# Altium schematic sheet vme_can_vme_1.SchDoc: =GlobalProjectName
size 410 x 297 mm; SheetNumber: 8; SheetTotal: 8; PageSetup: Record=PageOptions|CenterHorizontal=True|CenterVertical=True|PrintScale=1.00|XCorrection=1.00|YCorrection=1.00|PrintKind=1|BorderSize=5000000|LeftOffset=0|BottomOffset=0|Orientation=2|PaperLength=1000|PaperWidth=1000|Scale=100|PaperSource=15|PrintQuality=1200|MediaType=1|DitherType=10|PaperKind=A3|PrintScaleMode=1; Weight: -; ScaleFactor: -
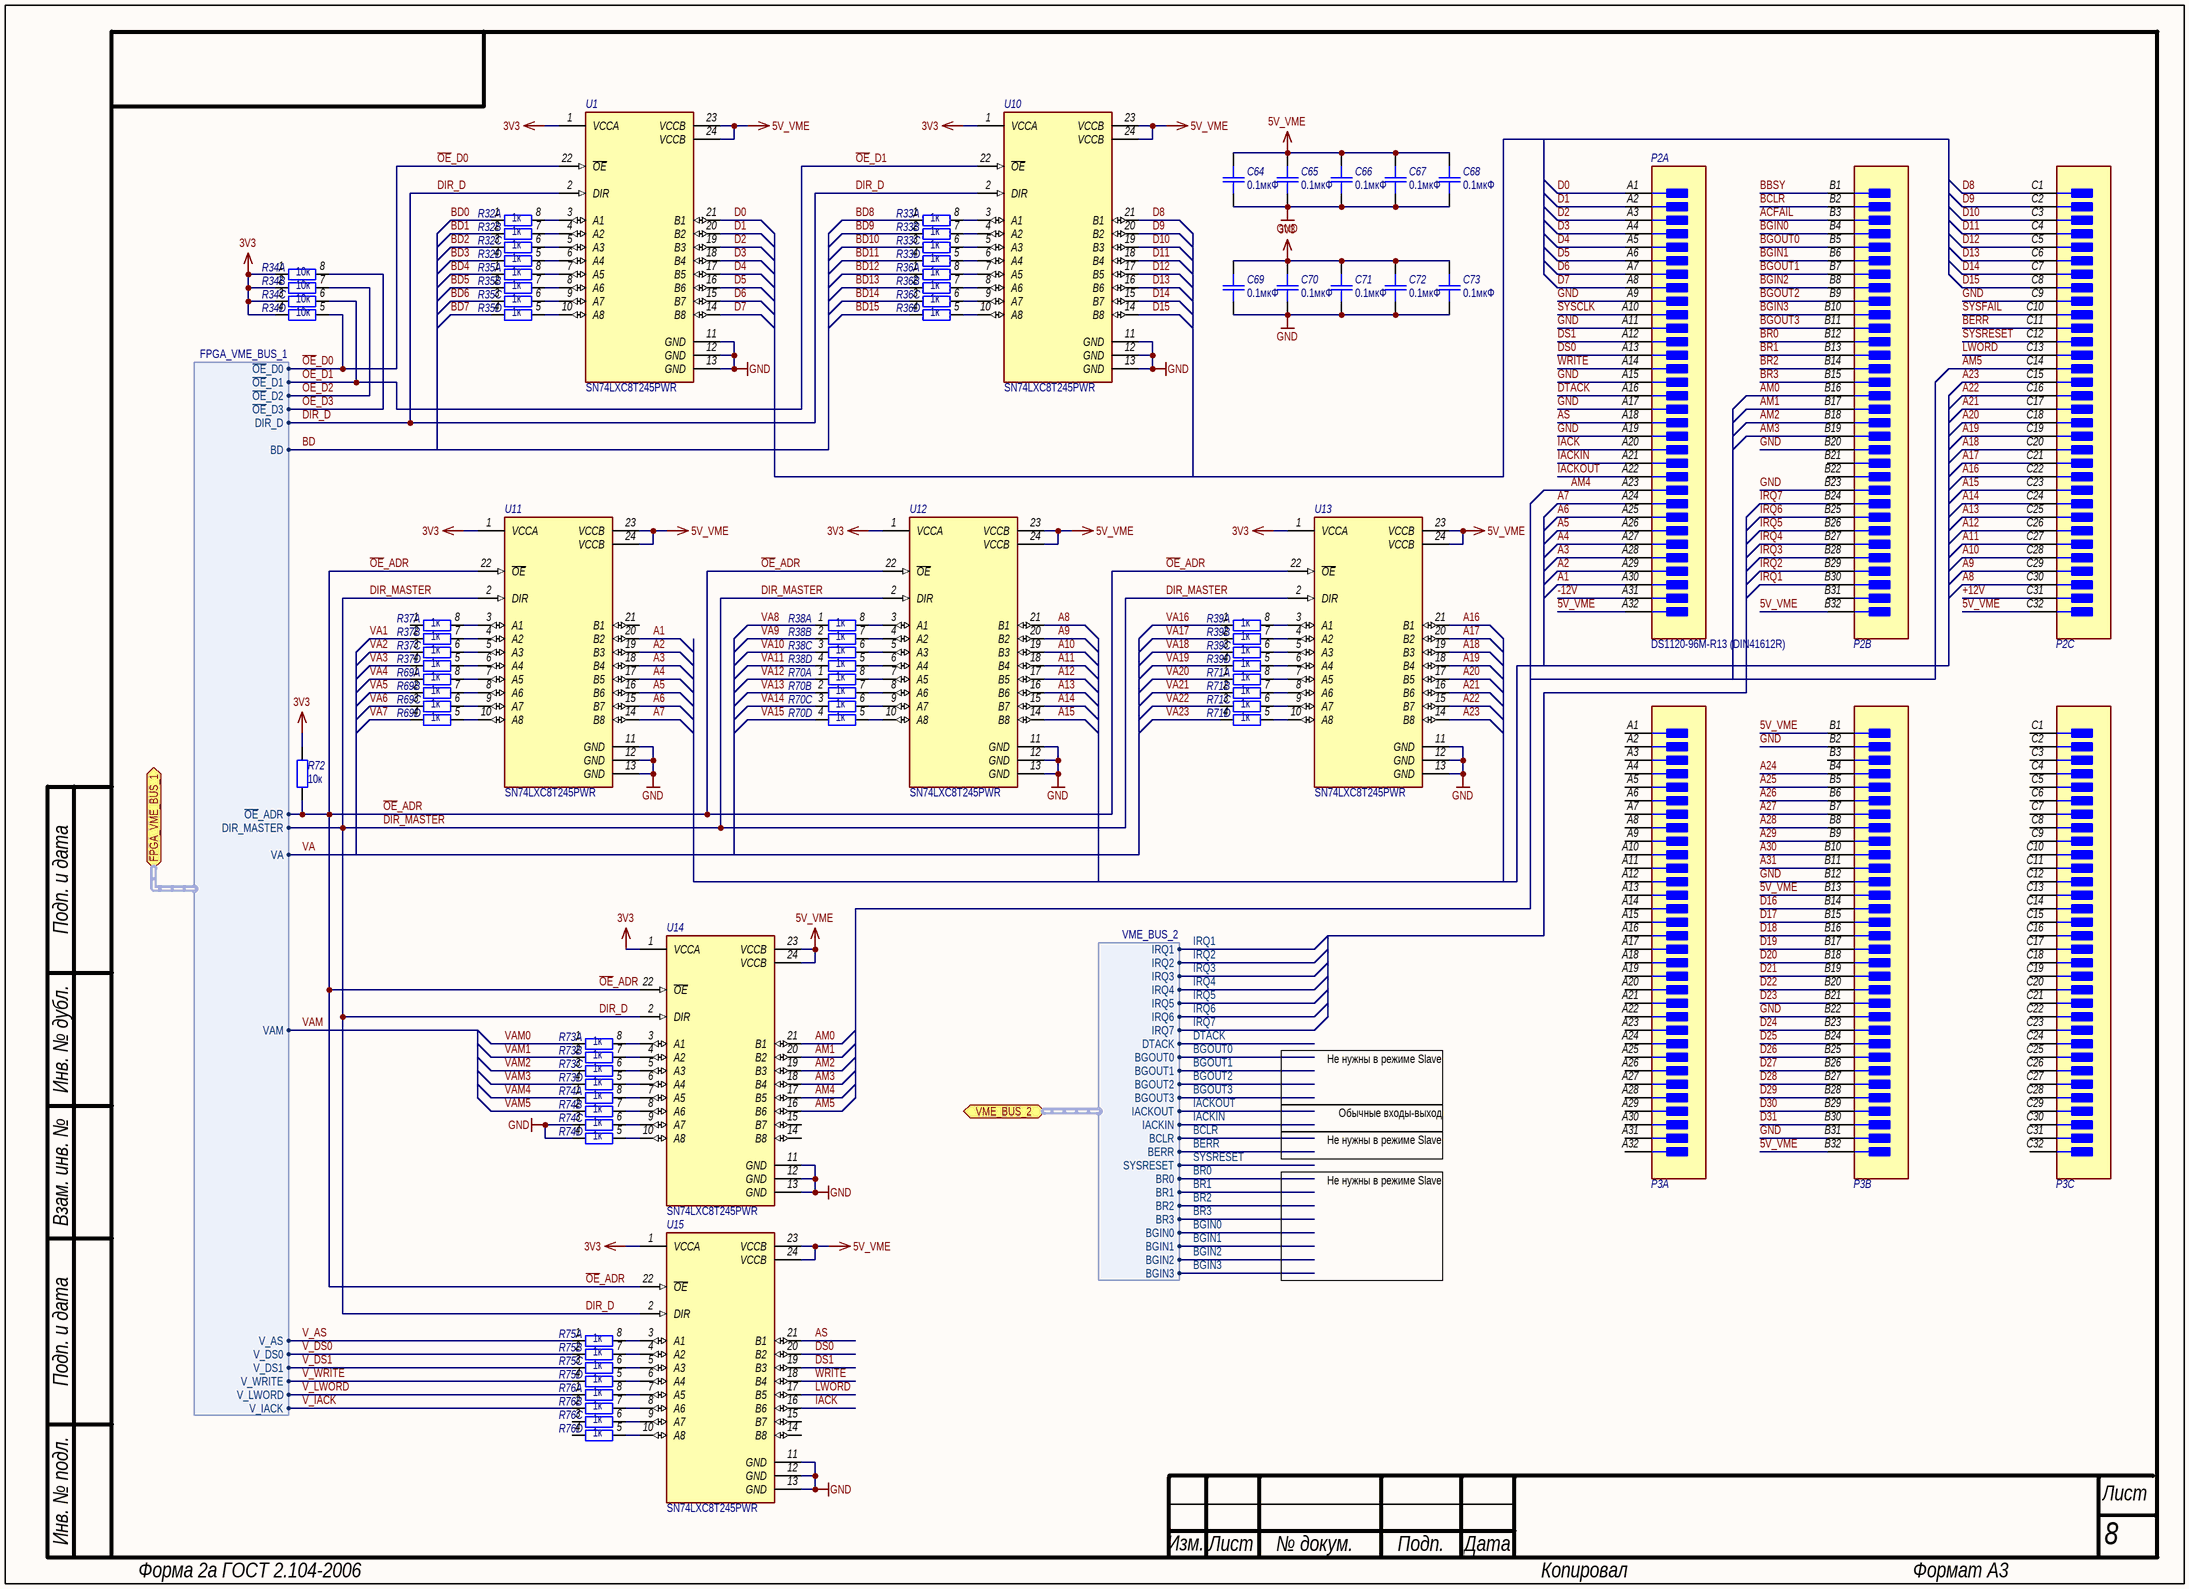
[diagram p0: vme_can_vme_1.SchDoc]

## Parts
C64  0.1мкФ  [SMD_C0805]
C65  0.1мкФ  [SMD_C0805]
C66  0.1мкФ  [SMD_C0805]
C67  0.1мкФ  [SMD_C0805]
C68  0.1мкФ  [SMD_C0805]
C69  0.1мкФ  [SMD_C0805]
C70  0.1мкФ  [SMD_C0805]
C71  0.1мкФ  [SMD_C0805]
C72  0.1мкФ  [SMD_C0805]
C73  0.1мкФ  [SMD_C0805]
P2  DS1120-96M-R13 (DIN41612R)  [DS1120-96M-R13]  (parts A,B,C of 3)
P3  DS1120-96M-R13 (DIN41612R)  [DS1120-96M-R13]  (value not drawn)  (parts A,B,C of 3)
R32  value 1к  [TC124]  (hidden comment: 4 Chip Resistor Array)  (parts A,B,C,D of 4)
R33  value 1к  [TC124]  (hidden comment: 4 Chip Resistor Array)  (parts A,B,C,D of 4)
R34  value 10к  [TC124]  (hidden comment: 4 Chip Resistor Array)  (parts A,B,C,D of 4)
R35  value 1к  [TC124]  (hidden comment: 4 Chip Resistor Array)  (parts A,B,C,D of 4)
R36  value 1к  [TC124]  (hidden comment: 4 Chip Resistor Array)  (parts A,B,C,D of 4)
R37  value 1к  [TC124]  (hidden comment: 4 Chip Resistor Array)  (parts A,B,C,D of 4)
R38  value 1к  [TC124]  (hidden comment: 4 Chip Resistor Array)  (parts A,B,C,D of 4)
R39  value 1к  [TC124]  (hidden comment: 4 Chip Resistor Array)  (parts A,B,C,D of 4)
R69  value 1к  [TC124]  (hidden comment: 4 Chip Resistor Array)  (parts A,B,C,D of 4)
R70  value 1к  [TC124]  (hidden comment: 4 Chip Resistor Array)  (parts A,B,C,D of 4)
R71  value 1к  [TC124]  (hidden comment: 4 Chip Resistor Array)  (parts A,B,C,D of 4)
R72  10к  [SMD_0805]
R73  value 1к  [TC124]  (hidden comment: 4 Chip Resistor Array)  (parts A,B,C,D of 4)
R74  value 1к  [TC124]  (hidden comment: 4 Chip Resistor Array)  (parts A,B,C,D of 4)
R75  value 1к  [TC124]  (hidden comment: 4 Chip Resistor Array)  (parts A,B,C,D of 4)
R76  value 1к  [TC124]  (hidden comment: 4 Chip Resistor Array)  (parts A,B,C,D of 4)
U1  SN74LXC8T245PWR  [TSSOP-24]
U10  SN74LXC8T245PWR  [TSSOP-24]
U11  SN74LXC8T245PWR  [TSSOP-24]
U12  SN74LXC8T245PWR  [TSSOP-24]
U13  SN74LXC8T245PWR  [TSSOP-24]
U14  SN74LXC8T245PWR  [TSSOP-24]
U15  SN74LXC8T245PWR  [TSSOP-24]

## Ports
FPGA_VME_BUS_1 (bidir, harness FPGA_VME_BUS_1), VME_BUS_2 (bidir, harness VME_BUS_2)

## Harnesses
VME_BUS_2: IRQ1, IRQ2, IRQ3, IRQ4, IRQ5, IRQ6, IRQ7, DTACK, BGOUT0, BGOUT1, BGOUT2, BGOUT3, IACKOUT, IACKIN, BCLR, BERR, SYSRESET, BR0, BR1, BR2, BR3, BGIN0, BGIN1, BGIN2, BGIN3
FPGA_VME_BUS_1: ~{OE}_D0, ~{OE}_D1, ~{OE}_D2, ~{OE}_D3, DIR_D, BD, ~{OE}_ADR, DIR_MASTER, VA, VAM, V_AS, V_DS0, V_DS1, V_WRITE, V_LWORD, V_IACK

## Nets
3V3: C69.2 C70.2 C71.2 C72.2 C73.2 R34.1 R34.2 R34.3 R34.4 R72.2 U1.1(VCCA) U10.1(VCCA) U11.1(VCCA) U12.1(VCCA) U13.1(VCCA) U14.1(VCCA) U15.1(VCCA)
5V_VME: C64.2 C65.2 C66.2 C67.2 C68.2 P2.A32 P2.B32 P2.C32 P3.B1 P3.B13 P3.B32 U1.23(VCCB) U1.24(VCCB) U10.23(VCCB) U10.24(VCCB) U11.23(VCCB) U11.24(VCCB) U12.23(VCCB) U12.24(VCCB) U13.23(VCCB) U13.24(VCCB) U14.23(VCCB) U14.24(VCCB) U15.23(VCCB) U15.24(VCCB)
GND: C64.1 C65.1 C66.1 C67.1 C68.1 C69.1 C70.1 C71.1 C72.1 C73.1 P2.A9 P2.A11 P2.A15 P2.A17 P2.A19 P2.B20 P2.B23 P2.C9 P3.B2 P3.B12 P3.B22 P3.B31 R74.3 R74.4 U1.11(GND) U1.12(GND) U1.13(GND) U10.11(GND) U10.12(GND) U10.13(GND) U11.11(GND) U11.12(GND) U11.13(GND) U12.11(GND) U12.12(GND) U12.13(GND) U13.11(GND) U13.12(GND) U13.13(GND) U14.11(GND) U14.12(GND) U14.13(GND) U15.11(GND) U15.12(GND) U15.13(GND)
+12V: P2.C31
-12V: P2.A31
A1: P2.A30 U11.20(B2)
A2: P2.A29 U11.19(B3)
A3: P2.A28 U11.18(B4)
A4: P2.A27 U11.17(B5)
A5: P2.A26 U11.16(B6)
A6: P2.A25 U11.15(B7)
A7: P2.A24 U11.14(B8)
A8: P2.C30 U12.21(B1)
A9: P2.C29 U12.20(B2)
A10: P2.C28 U12.19(B3)
A11: P2.C27 U12.18(B4)
A12: P2.C26 U12.17(B5)
A13: P2.C25 U12.16(B6)
A14: P2.C24 U12.15(B7)
A15: P2.C23 U12.14(B8)
A16: P2.C22 U13.21(B1)
A17: P2.C21 U13.20(B2)
A18: P2.C20 U13.19(B3)
A19: P2.C19 U13.18(B4)
A20: P2.C18 U13.17(B5)
A21: P2.C17 U13.16(B6)
A22: P2.C16 U13.15(B7)
A23: P2.C15 U13.14(B8)
A24: P3.B4
A25: P3.B5
A26: P3.B6
A27: P3.B7
A28: P3.B8
A29: P3.B9
A30: P3.B10
A31: P3.B11
ACFAIL: P2.B3
AM0: P2.B16 U14.21(B1)
AM1: P2.B17 U14.20(B2)
AM2: P2.B18 U14.19(B3)
AM3: P2.B19 U14.18(B4)
AM4: P2.A23 U14.17(B5)
AM5: P2.C14 U14.16(B6)
AS: P2.A18 U15.21(B1)
BBSY: P2.B1
BCLR: P2.B2 ; port VME_BUS_2.BCLR
BD0: R32.1
BD1: R32.2
BD2: R32.3
BD3: R32.4
BD4: R35.1
BD5: R35.2
BD6: R35.3
BD7: R35.4
BD8: R33.1
BD9: R33.2
BD10: R33.3
BD11: R33.4
BD12: R36.1
BD13: R36.2
BD14: R36.3
BD15: R36.4
BERR: P2.C11 ; port VME_BUS_2.BERR
BGIN0: P2.B4 ; port VME_BUS_2.BGIN0
BGIN1: P2.B6 ; port VME_BUS_2.BGIN1
BGIN2: P2.B8 ; port VME_BUS_2.BGIN2
BGIN3: P2.B10 ; port VME_BUS_2.BGIN3
BGOUT0: P2.B5 ; port VME_BUS_2.BGOUT0
BGOUT1: P2.B7 ; port VME_BUS_2.BGOUT1
BGOUT2: P2.B9 ; port VME_BUS_2.BGOUT2
BGOUT3: P2.B11 ; port VME_BUS_2.BGOUT3
BR0: P2.B12 ; port VME_BUS_2.BR0
BR1: P2.B13 ; port VME_BUS_2.BR1
BR2: P2.B14 ; port VME_BUS_2.BR2
BR3: P2.B15 ; port VME_BUS_2.BR3
D0: P2.A1 U1.21(B1)
D1: P2.A2 U1.20(B2)
D2: P2.A3 U1.19(B3)
D3: P2.A4 U1.18(B4)
D4: P2.A5 U1.17(B5)
D5: P2.A6 U1.16(B6)
D6: P2.A7 U1.15(B7)
D7: P2.A8 U1.14(B8)
D8: P2.C1 U10.21(B1)
D9: P2.C2 U10.20(B2)
D10: P2.C3 U10.19(B3)
D11: P2.C4 U10.18(B4)
D12: P2.C5 U10.17(B5)
D13: P2.C6 U10.16(B6)
D14: P2.C7 U10.15(B7)
D15: P2.C8 U10.14(B8)
D16: P3.B14
D17: P3.B15
D18: P3.B16
D19: P3.B17
D20: P3.B18
D21: P3.B19
D22: P3.B20
D23: P3.B21
D24: P3.B23
D25: P3.B24
D26: P3.B25
D27: P3.B26
D28: P3.B27
D29: P3.B28
D30: P3.B29
D31: P3.B30
DIR_D: U1.2(DIR) U10.2(DIR) U11.2(DIR) U12.2(DIR) U13.2(DIR) U14.2(DIR) U15.2(DIR) ; port FPGA_VME_BUS_1.DIR_D, port FPGA_VME_BUS_1.DIR_MASTER  [also labelled DIR_MASTER]
DS0: P2.A13 U15.20(B2)
DS1: P2.A12 U15.19(B3)
DTACK: P2.A16 ; port VME_BUS_2.DTACK
IACK: P2.A20 U15.16(B6)
IACKIN: P2.A21 ; port VME_BUS_2.IACKIN
IACKOUT: P2.A22 ; port VME_BUS_2.IACKOUT
IRQ1: P2.B30 ; port VME_BUS_2.IRQ1
IRQ2: P2.B29 ; port VME_BUS_2.IRQ2
IRQ3: P2.B28 ; port VME_BUS_2.IRQ3
IRQ4: P2.B27 ; port VME_BUS_2.IRQ4
IRQ5: P2.B26 ; port VME_BUS_2.IRQ5
IRQ6: P2.B25 ; port VME_BUS_2.IRQ6
IRQ7: P2.B24 ; port VME_BUS_2.IRQ7
LWORD: P2.C13 U15.17(B5)
~{OE}_ADR: R72.1 U11.22(~{OE}) U12.22(~{OE}) U13.22(~{OE}) U14.22(~{OE}) U15.22(~{OE}) ; port FPGA_VME_BUS_1.~{OE}_ADR
~{OE}_D0: R34.5 U1.22(~{OE}) ; port FPGA_VME_BUS_1.~{OE}_D0
~{OE}_D1: R34.6 U10.22(~{OE}) ; port FPGA_VME_BUS_1.~{OE}_D1
~{OE}_D2: R34.7 ; port FPGA_VME_BUS_1.~{OE}_D2
~{OE}_D3: R34.8 ; port FPGA_VME_BUS_1.~{OE}_D3
SYSCLK: P2.A10
SYSFAIL: P2.C10
SYSRESET: P2.C12 ; port VME_BUS_2.SYSRESET
V_AS: R75.1 ; port FPGA_VME_BUS_1.V_AS
V_DS0: R75.2 ; port FPGA_VME_BUS_1.V_DS0
V_DS1: R75.3 ; port FPGA_VME_BUS_1.V_DS1
V_IACK: R76.2 ; port FPGA_VME_BUS_1.V_IACK
V_LWORD: R76.1 ; port FPGA_VME_BUS_1.V_LWORD
V_WRITE: R75.4 ; port FPGA_VME_BUS_1.V_WRITE
VA1: R37.2
VA2: R37.3
VA3: R37.4
VA4: R69.1
VA5: R69.2
VA6: R69.3
VA7: R69.4
VA8: R38.1
VA9: R38.2
VA10: R38.3
VA11: R38.4
VA12: R70.1
VA13: R70.2
VA14: R70.3
VA15: R70.4
VA16: R39.1
VA17: R39.2
VA18: R39.3
VA19: R39.4
VA20: R71.1
VA21: R71.2
VA22: R71.3
VA23: R71.4
VAM0: R73.1
VAM1: R73.2
VAM2: R73.3
VAM3: R73.4
VAM4: R74.1
VAM5: R74.2
WRITE: P2.A14 U15.18(B4)
NetR32_5: R32.5 U1.6(A4)
NetR32_6: R32.6 U1.5(A3)
NetR32_7: R32.7 U1.4(A2)
NetR32_8: R32.8 U1.3(A1)
NetR33_5: R33.5 U10.6(A4)
NetR33_6: R33.6 U10.5(A3)
NetR33_7: R33.7 U10.4(A2)
NetR33_8: R33.8 U10.3(A1)
NetR35_5: R35.5 U1.10(A8)
NetR35_6: R35.6 U1.9(A7)
NetR35_7: R35.7 U1.8(A6)
NetR35_8: R35.8 U1.7(A5)
NetR36_5: R36.5 U10.10(A8)
NetR36_6: R36.6 U10.9(A7)
NetR36_7: R36.7 U10.8(A6)
NetR36_8: R36.8 U10.7(A5)
NetR37_5: R37.5 U11.6(A4)
NetR37_6: R37.6 U11.5(A3)
NetR37_7: R37.7 U11.4(A2)
NetR37_8: R37.8 U11.3(A1)
NetR38_5: R38.5 U12.6(A4)
NetR38_6: R38.6 U12.5(A3)
NetR38_7: R38.7 U12.4(A2)
NetR38_8: R38.8 U12.3(A1)
NetR39_5: R39.5 U13.6(A4)
NetR39_6: R39.6 U13.5(A3)
NetR39_7: R39.7 U13.4(A2)
NetR39_8: R39.8 U13.3(A1)
NetR69_5: R69.5 U11.10(A8)
NetR69_6: R69.6 U11.9(A7)
NetR69_7: R69.7 U11.8(A6)
NetR69_8: R69.8 U11.7(A5)
NetR70_5: R70.5 U12.10(A8)
NetR70_6: R70.6 U12.9(A7)
NetR70_7: R70.7 U12.8(A6)
NetR70_8: R70.8 U12.7(A5)
NetR71_5: R71.5 U13.10(A8)
NetR71_6: R71.6 U13.9(A7)
NetR71_7: R71.7 U13.8(A6)
NetR71_8: R71.8 U13.7(A5)
NetR73_5: R73.5 U14.6(A4)
NetR73_6: R73.6 U14.5(A3)
NetR73_7: R73.7 U14.4(A2)
NetR73_8: R73.8 U14.3(A1)
NetR74_5: R74.5 U14.10(A8)
NetR74_6: R74.6 U14.9(A7)
NetR74_7: R74.7 U14.8(A6)
NetR74_8: R74.8 U14.7(A5)
NetR75_5: R75.5 U15.6(A4)
NetR75_6: R75.6 U15.5(A3)
NetR75_7: R75.7 U15.4(A2)
NetR75_8: R75.8 U15.3(A1)
NetR76_5: R76.5 U15.10(A8)
NetR76_6: R76.6 U15.9(A7)
NetR76_7: R76.7 U15.8(A6)
NetR76_8: R76.8 U15.7(A5)

Not connected (* = marked no-connect by the designer): P2 B21 B22 B31; P3 A1 A2 A3 A4 A5 A6 A7 A8 A9 A10 A11 A12 A13 A14 A15 A16 A17 A18 A19 A20 A21 A22 A23 A24 A25 A26 A27 A28 A29 A30 A31 A32 B3 C1 C2 C3 C4 C5 C6 C7 C8 C9 C10 C11 C12 C13 C14 C15 C16 C17 C18 C19 C20 C21 C22 C23 C24 C25 C26 C27 C28 C29 C30 C31 C32; R37 1; R76 3 4; U11 21(B1); U14 14(B8) 15(B7); U15 14(B8) 15(B7)

## Buses and harness runs
bus BD
bus VA
bus VAM

## Notes on the sheet
- Не нужны в режиме Slave
- Обычные входы-выход
- Подп. и дата
- Инв. № дубл.
- Взам. инв. №
- Инв. № подл.
- Изм.
- Лист
- № докум.
- Подп.
- Дата
- Форма 2а ГОСТ 2.104-2006
- Копировал
- Формат А3

## Library data of the parts
C64-C73 = Capacitor: Назначение: SMD-конденсатор; Наименование: Конденсатор; Потребление, Вт: 0; Value: 0.1мкФ
P2 P3 = DS1120-96M-R13: Conn Backplane PL 96 POS 2.54mm Solder RA Thru-Hole Box; Manufacturer: TE; Manufacturer Part Number: 5650473-5; Conn Gender: Male; Number Of Contacts: 96; Current Rating: 1.5A; Conn Orientation: Right Angle; Voltage Rating: 250V; Потребление, Вт: 0.0; ComponentLink2URL: http://outer.connfly.group/static/upload/file/pdf/DS1119.pdf; RoHS: TRUE; Lead Free: Yes; Package: 5650473-5; Number Of Rows: 3; Device Class L3: unset; Contact Material: Gold,Nickel; Device Class L1: Connectors; Footprint Url: https://www.te.com/commerce/DocumentDelivery/DDEController?Action=showdoc&DocId=Customer+Drawing%7F5650473%7FC%7Fpdf%7FEnglish%7FENG_CD_5650473_C.pdf%7F5650473-5; Temperature: -55°C to +105°C; ComponentLink2Description: Datasheet; Device Class L2: Backplane Connectors; Category: Conn; Height: 11.1mm; Octopart: https://octopart.com/5650473-5-te+connectivity-39687507; Pitch: 2.54mm; Digikey Description: CONN DIN PLUG 96POS PCB RA GOLD; Mouser Description: Conn DIN 41612 PIN 96 POS 2.54mm Solder RA Thru-Hole Box; Temperature Range Low: -55°C; Automotive: No; Temperature Range High: +105°C; Назначение: Conn Backplane PL 96 POS 2.54mm Solder RA Thru-Hole Box; Наименование: DS1120-96M-R13 (DIN41612R)
R32-R39 R69-R71 R73-R76 = Resistor-4: Потребление, Вт: 0.0; Назначение: 4 Chip Resistor Array; Наименование: 4 Chip Resistor Array
R72 = Resistor: Наименование: Резистор; Назначение: SMD-резистор; Потребление, Вт: 0,001; Value: 10к
U1 U10-U15 = SN74LXC8T245PWR: Dual-Supply Bus Transceiver with Configurable Level Shifting / and 3-State Outputs; Потрбление, Вт: 0.01; ComponentLink2Description: Datasheet; ComponentLink2URL: http://www.ti.com/lit/ds/symlink/sn74lxc8t245.pdf; Назначение: Dual-Supply Bus Transceiver with Configurable Level Shifting; Наименование: SN74LXC8T245PWR